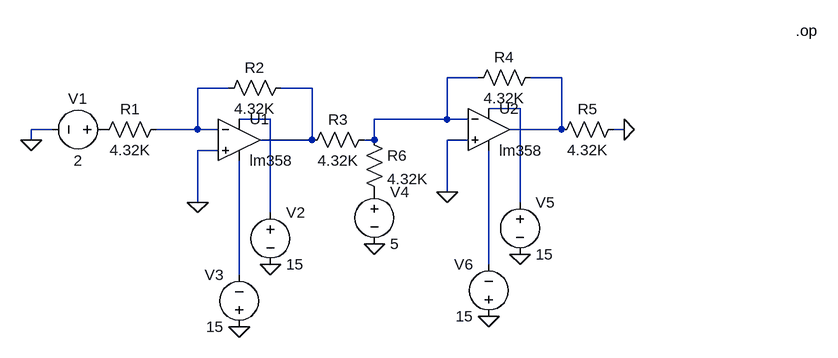
[diagram p0: schematic Subtraction.asc]
Subtraction.asc, the LTspice schematic file:
Version 4
SHEET 1 1168 680
WIRE 640 32 592 32
WIRE 768 32 720 32
WIRE 256 48 208 48
WIRE 384 48 336 48
WIRE 704 80 656 80
WIRE 320 96 272 96
WIRE 592 96 592 32
WIRE 592 96 480 96
WIRE 624 96 592 96
WIRE -16 112 -48 112
WIRE 208 112 208 48
WIRE 208 112 144 112
WIRE 240 112 208 112
WIRE 768 112 768 32
WIRE 768 112 688 112
WIRE 864 112 848 112
WIRE -48 128 -48 112
WIRE 384 128 384 48
WIRE 384 128 304 128
WIRE 480 128 480 96
WIRE 480 128 464 128
WIRE 624 128 592 128
WIRE 240 144 208 144
WIRE 592 208 592 128
WIRE 208 224 208 144
WIRE 704 224 704 80
WIRE 320 240 320 96
WIRE 656 320 656 144
WIRE 272 336 272 160
FLAG -48 128 0
FLAG 480 288 0
FLAG 208 224 0
FLAG 272 416 0
FLAG 320 320 0
FLAG 592 208 0
FLAG 656 400 0
FLAG 704 304 0
FLAG 864 112 0
SYMBOL voltage 80 112 R90
WINDOW 0 -32 56 VBottom 2
WINDOW 3 32 56 VTop 2
WINDOW 123 0 0 Left 0
WINDOW 39 0 0 Left 0
SYMATTR InstName V1
SYMATTR Value 2
SYMBOL res 160 96 R90
WINDOW 0 0 56 VBottom 2
WINDOW 3 32 56 VTop 2
SYMATTR InstName R1
SYMATTR Value 4.32K
SYMATTR SpiceLine tol=1 pwr=0.1
SYMBOL res 464 112 R0
SYMATTR InstName R6
SYMATTR Value 4.32K
SYMATTR SpiceLine tol=1 pwr=0.1
SYMBOL voltage 480 192 R0
WINDOW 123 0 0 Left 0
WINDOW 39 0 0 Left 0
SYMATTR InstName V4
SYMATTR Value 5
SYMBOL OpAmps\\lm358 272 64 R0
SYMATTR InstName U1
SYMBOL res 352 32 R90
WINDOW 0 0 56 VBottom 2
WINDOW 3 32 56 VTop 2
SYMATTR InstName R2
SYMATTR Value 4.32K
SYMATTR SpiceLine tol=1 pwr=0.1
SYMBOL voltage 320 224 R0
WINDOW 123 0 0 Left 0
WINDOW 39 0 0 Left 0
SYMATTR InstName V2
SYMATTR Value 15
SYMBOL res 480 112 R90
WINDOW 0 0 56 VBottom 2
WINDOW 3 32 56 VTop 2
SYMATTR InstName R3
SYMATTR Value 4.32K
SYMATTR SpiceLine tol=1 pwr=0.1
SYMBOL voltage 272 432 R180
WINDOW 0 24 96 Left 2
WINDOW 3 24 16 Left 2
WINDOW 123 0 0 Left 0
WINDOW 39 0 0 Left 0
SYMATTR InstName V3
SYMATTR Value 15
SYMBOL OpAmps\\lm358 656 48 R0
SYMATTR InstName U2
SYMBOL res 736 16 R90
WINDOW 0 0 56 VBottom 2
WINDOW 3 32 56 VTop 2
SYMATTR InstName R4
SYMATTR Value 4.32K
SYMATTR SpiceLine tol=1 pwr=0.1
SYMBOL voltage 704 208 R0
WINDOW 123 0 0 Left 0
WINDOW 39 0 0 Left 0
SYMATTR InstName V5
SYMATTR Value 15
SYMBOL res 864 96 R90
WINDOW 0 0 56 VBottom 2
WINDOW 3 32 56 VTop 2
SYMATTR InstName R5
SYMATTR Value 4.32K
SYMATTR SpiceLine tol=1 pwr=0.1
SYMBOL voltage 656 416 R180
WINDOW 0 24 96 Left 2
WINDOW 3 24 16 Left 2
WINDOW 123 0 0 Left 0
WINDOW 39 0 0 Left 0
SYMATTR InstName V6
SYMATTR Value 15
TEXT 1128 -40 Left 2 !.op

The netlist it stands for:
* Subtraction.asc
V1 P001 0 2
R1 N003 P001 4.32K tol=1 pwr=0.1
R6 N001 P002 4.32K tol=1 pwr=0.1
V4 P002 0 5
XU1 0 N003 N006 N008 N004 lm358  ; pins In+ In- V+ V- OUT
R2 N004 N003 4.32K tol=1 pwr=0.1
V2 N006 0 15
R3 N001 N004 4.32K tol=1 pwr=0.1
V3 0 N008 15
XU2 0 N001 N005 N007 N002 lm358  ; pins In+ In- V+ V- OUT
R4 N002 N001 4.32K tol=1 pwr=0.1
V5 N005 0 15
R5 0 N002 4.32K tol=1 pwr=0.1
V6 0 N007 15
.op
.backanno
.end